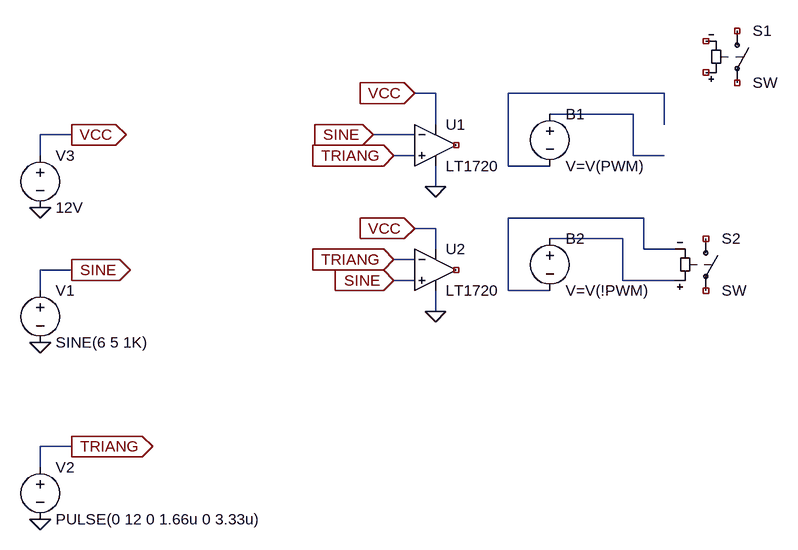
[diagram p0: schematic Draft1.asc]
Draft1.asc, the LTspice schematic file:
Version 4
SHEET 1 880 704
WIRE 64 32 32 32
WIRE 416 32 176 32
WIRE 368 64 240 64
WIRE 64 80 64 32
WIRE 416 80 416 32
WIRE -496 96 -544 96
WIRE 32 96 -32 96
WIRE -544 128 -544 96
WIRE 32 128 0 128
WIRE 368 128 368 64
WIRE 416 128 368 128
WIRE 176 144 176 32
WIRE 240 144 176 144
WIRE 64 176 64 144
WIRE 384 224 176 224
WIRE 64 240 32 240
WIRE 352 256 240 256
WIRE 64 272 64 240
WIRE 384 272 384 224
WIRE 432 272 384 272
WIRE 32 288 0 288
WIRE -496 304 -544 304
WIRE 32 320 0 320
WIRE 352 320 352 256
WIRE 432 320 352 320
WIRE -544 336 -544 304
WIRE 176 336 176 224
WIRE 240 336 176 336
WIRE 64 368 64 336
WIRE -496 576 -544 576
WIRE -544 608 -544 576
FLAG -496 96 VCC
IOPIN -496 96 Out
FLAG -544 208 0
FLAG -496 304 SINE
IOPIN -496 304 Out
FLAG -544 416 0
FLAG -496 576 TRIANG
IOPIN -496 576 Out
FLAG -544 688 0
FLAG 32 32 VCC
IOPIN 32 32 In
FLAG -32 96 SINE
IOPIN -32 96 In
FLAG 0 128 TRIANG
IOPIN 0 128 In
FLAG 64 176 0
FLAG 32 240 VCC
IOPIN 32 240 In
FLAG 0 288 TRIANG
IOPIN 0 288 In
FLAG 0 320 SINE
IOPIN 0 320 In
FLAG 64 368 0
SYMBOL Comparators/LT1720 64 48 R0
SYMATTR InstName U1
SYMBOL Comparators/LT1720 64 240 R0
SYMATTR InstName U2
SYMBOL Voltage -544 112 R0
SYMATTR InstName V3
SYMATTR Value 12V
SYMBOL Voltage -544 320 R0
SYMATTR InstName V1
SYMATTR Value SINE(6 5 1K)
SYMBOL Voltage -544 592 R0
SYMATTR InstName V2
SYMATTR Value PULSE(0 12 0 1.66u 0 3.33u)
SYMBOL Voltage 240 48 R0
SYMATTR InstName B1
SYMATTR Value V=V(PWM)
SYMBOL Voltage 240 240 R0
SYMATTR InstName B2
SYMATTR Value V=V(!PWM)
SYMBOL sw 528 -80 R0
SYMATTR InstName S1
SYMBOL sw 480 240 R0
SYMATTR InstName S2

The netlist it stands for:
* Draft1.asc
XU1 TRIANG SINE VCC 0 NC_01 LT1720  ; pins In+ In- V+ V- OUT
XU2 SINE TRIANG VCC 0 NC_02 LT1720  ; pins In+ In- V+ V- OUT
V3 VCC 0 12V
V1 SINE 0 SINE(6 5 1K)
V2 TRIANG 0 PULSE(0 12 0 1.66u 0 3.33u)
V§B1 N002 N001 V=V(PWM)
V§B2 N004 N003 V=V(!PWM)
S1 NC_03 NC_04 NC_05 NC_06 SW
S2 NC_07 NC_08 N004 N003 SW
.lib LT1720.sub
.backanno
.end